# Altium schematic sheet GPIO_EXPANDER_B.SchDoc
size A; SheetNumber: 9; SheetTotal: 12
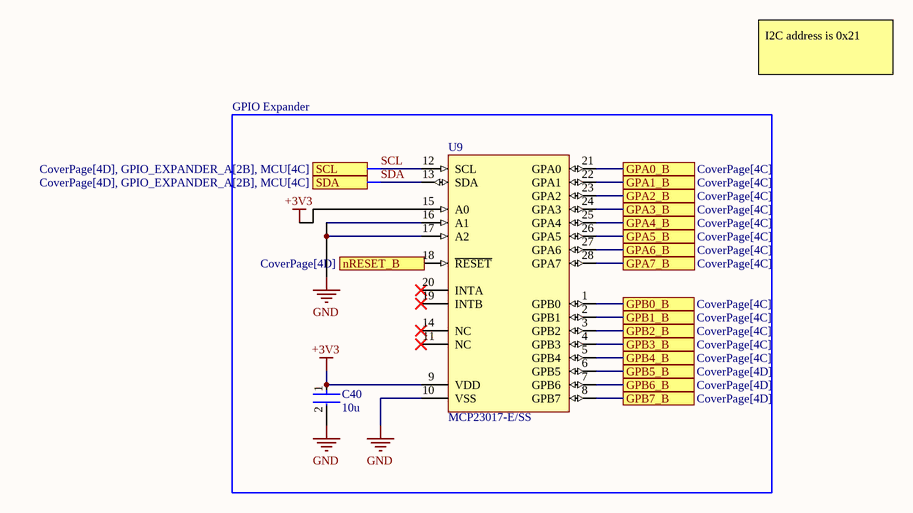
[diagram p0: GPIO_EXPANDER_B.SchDoc]

## Parts
C40  10u  [FP-C0805C-DG-MFG]
U9  MCP23017-E/SS  [SSOP-SS28_N]

## Ports
GPA0_B (see CoverPage[4C]), GPA1_B (see CoverPage[4C]), GPA2_B (see CoverPage[4C]), GPA3_B (see CoverPage[4C]), GPA4_B (see CoverPage[4C]), GPA5_B (see CoverPage[4C]), GPA6_B (see CoverPage[4C]), GPA7_B (see CoverPage[4C]), GPB0_B (see CoverPage[4C]), GPB1_B (see CoverPage[4C]), GPB2_B (see CoverPage[4C]), GPB3_B (see CoverPage[4C]), GPB4_B (see CoverPage[4C]), GPB5_B (see CoverPage[4D]), GPB6_B (see CoverPage[4D]), GPB7_B (see CoverPage[4D]), nRESET_B (in, see CoverPage[4D]), SCL (see CoverPage[4D], GPIO_EXPANDER_A[2B], MCU[4C]), SDA (see CoverPage[4D], GPIO_EXPANDER_A[2B], MCU[4C])

## Nets
+3V3: C40.1 U9.9(VDD) U9.15(A0)
GND: C40.2 U9.10(VSS) U9.16(A1) U9.17(A2)
GPA0_B: U9.21(GPA0) ; port GPA0_B
GPA1_B: U9.22(GPA1) ; port GPA1_B
GPA2_B: U9.23(GPA2) ; port GPA2_B
GPA3_B: U9.24(GPA3) ; port GPA3_B
GPA4_B: U9.25(GPA4) ; port GPA4_B
GPA5_B: U9.26(GPA5) ; port GPA5_B
GPA6_B: U9.27(GPA6) ; port GPA6_B
GPA7_B: U9.28(GPA7) ; port GPA7_B
GPB0_B: U9.1(GPB0) ; port GPB0_B
GPB1_B: U9.2(GPB1) ; port GPB1_B
GPB2_B: U9.3(GPB2) ; port GPB2_B
GPB3_B: U9.4(GPB3) ; port GPB3_B
GPB4_B: U9.5(GPB4) ; port GPB4_B
GPB5_B: U9.6(GPB5) ; port GPB5_B
GPB6_B: U9.7(GPB6) ; port GPB6_B
GPB7_B: U9.8(GPB7) ; port GPB7_B
SCL: U9.12(SCL) ; port SCL
SDA: U9.13(SDA) ; port SDA

Not connected (* = marked no-connect by the designer): U9 11(NC)* 14(NC)* 18(~{RESET}) 19(INTB)* 20(INTA)*

## Notes on the sheet
- GPIO Expander
- I2C address is 0x21

## Library data of the parts
C40 = CMP-2007-03243-2: CAP CER 10UF 10V X5R 0805; Manufacturer Part Number: C0805C106K8PACTU; Manufacturer: Kemet; 3DS Part Number: 220-00001; Tolerance: 10%; Temperature Coefficient: 15%; Material: Ceramic; Device Class L2: Capacitors; Device Class L1: Passive Components; ComponentLink2URL: https://content.kemet.com/datasheets/KEM_C1006_X5R_SMD.pdf; Height: 1.4mm; Lead Free: Yes; Digikey Description: CAP CER 10UF 10V X5R 0805; Octopart: https://octopart.com/c0805c106k8pactu-kemet-98697; Capacitance: 10uF; Value: 10uF; Temperature Range Low: -55°C; Temperature: -55°C to +85°C; Automotive: No; Mouser Description: CAP CER 10UF 10V X5R 0805; Ipc Land Pattern Name: CAPC200125X125; Temperature Range High: +85°C; Voltage: 10V; RoHS: TRUE; Device Class L3: Ceramic Capacitors; ComponentLink2Description: Datasheet; Voltage Rating: 10V; Package: C0805C-DG; Temperature Characteristic: X5R; Category: Cap
U9 = CMP-0186-00176-2: 16-Bit I/O Expander with Serial Interface, 28-Pin SSOP, Extended Temperature; PackageVersion: revBB, Aug-2009; ComponentLink1Description: Manufacturer URL; ComponentLink3Description: Package Specification; PackageDescription: 28-Lead Plastic Shrink Small Outline (SS) - 5.3mm Body [SSOP]; ComponentLink1URL: http://www.microchip.com/; Code_JEDEC: MS-150; RevisionNote: URLs added.; ComponentLink3URL: http://www.microchip.com/stellent/groups/techpub_sg/documents/packagingspec/en012702.pdf; ComponentLink2URL: http://ww1.microchip.com/downloads/en/DeviceDoc/21952b.pdf; ComponentLink2Description: Datasheet; PackageReference: SSOP-SS28; DatasheetVersion: revB, Feb-2007